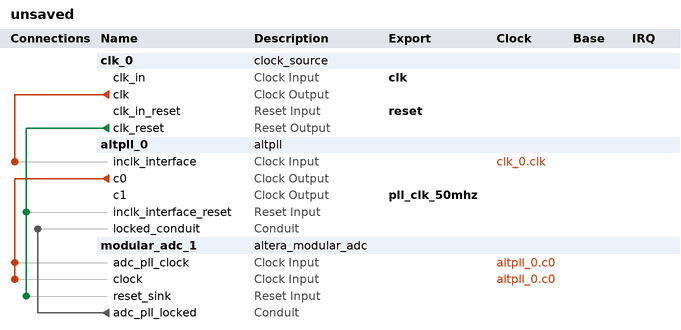
[diagram p0: system contents]
# Platform Designer (Qsys) system unsaved, MAX 10 10M04SAE144C8G
# Parameters at their usual value, and those the tool derives, are not listed.
package require -exact qsys 23.1
create_system unsaved
set_project_property DEVICE_FAMILY {MAX 10}
set_project_property DEVICE 10M04SAE144C8G

add_instance clk_0 clock_source 23.1
set_instance_parameter_value clk_0 clockFrequency 50000000

add_instance altpll_0 altpll 23.1
set_instance_parameter_value altpll_0 CLK0_DIVIDE_BY 24
set_instance_parameter_value altpll_0 CLK0_MULTIPLY_BY 5
set_instance_parameter_value altpll_0 CLK1_DIVIDE_BY 24
set_instance_parameter_value altpll_0 CLK1_DUTY_CYCLE 50
set_instance_parameter_value altpll_0 CLK1_MULTIPLY_BY 25
set_instance_parameter_value altpll_0 CLK1_PHASE_SHIFT 0
set_instance_parameter_value altpll_0 INCLK0_INPUT_FREQUENCY 20833
set_instance_parameter_value altpll_0 OPERATION_MODE NO_COMPENSATION
set_instance_parameter_value altpll_0 PORT_ARESET PORT_UNUSED
set_instance_parameter_value altpll_0 PORT_LOCKED PORT_USED
set_instance_parameter_value altpll_0 PORT_clk1 PORT_USED
set_instance_parameter_value altpll_0 PORT_clk2 PORT_UNUSED
set_instance_parameter_value altpll_0 PORT_clk3 PORT_UNUSED

add_instance modular_adc_1 altera_modular_adc 23.1
set_instance_parameter_value modular_adc_1 CLOCK_FREQ 10000000
set_instance_parameter_value modular_adc_1 CORE_VAR 0
set_instance_parameter_value modular_adc_1 DEVICE_PART 10M04SAE144C8G
set_instance_parameter_value modular_adc_1 clkdiv 2
set_instance_parameter_value modular_adc_1 int_vref_vr 3.3
set_instance_parameter_value modular_adc_1 refsel 1
set_instance_parameter_value modular_adc_1 sample_rate 0
set_instance_parameter_value modular_adc_1 seq_order_length 3
set_instance_parameter_value modular_adc_1 seq_order_slot_1 0
set_instance_parameter_value modular_adc_1 seq_order_slot_2 1
set_instance_parameter_value modular_adc_1 seq_order_slot_3 2
set_instance_parameter_value modular_adc_1 seq_order_slot_4 30
set_instance_parameter_value modular_adc_1 seq_order_slot_5 30
set_instance_parameter_value modular_adc_1 seq_order_slot_6 30
set_instance_parameter_value modular_adc_1 seq_order_slot_7 30
set_instance_parameter_value modular_adc_1 use_ch0 true
set_instance_parameter_value modular_adc_1 use_ch2 true
set_instance_parameter_value modular_adc_1 use_ch3 false
set_instance_parameter_value modular_adc_1 use_ch4 false
set_instance_parameter_value modular_adc_1 use_ch5 false
set_instance_parameter_value modular_adc_1 use_ch6 false
set_instance_parameter_value modular_adc_1 use_ch7 false
set_instance_parameter_value modular_adc_1 use_ch8 false
set_instance_parameter_value modular_adc_1 use_tsd false

# connections
add_connection altpll_0.c0 modular_adc_1.adc_pll_clock clock
add_connection altpll_0.c0 modular_adc_1.clock clock
add_connection clk_0.clk altpll_0.inclk_interface clock
add_connection clk_0.clk_reset altpll_0.inclk_interface_reset reset
add_connection clk_0.clk_reset modular_adc_1.reset_sink reset
add_connection modular_adc_1.adc_pll_locked altpll_0.locked_conduit conduit

# exported interfaces
add_interface clk clock sink
set_interface_property clk EXPORT_OF clk_0.clk_in
add_interface pll_clk_50mhz clock source
set_interface_property pll_clk_50mhz EXPORT_OF altpll_0.c1
add_interface reset reset sink
set_interface_property reset EXPORT_OF clk_0.clk_in_reset

set_interconnect_requirement {$system} qsys_mm.clockCrossingAdapter HANDSHAKE
set_interconnect_requirement {$system} qsys_mm.enableEccProtection FALSE
set_interconnect_requirement {$system} qsys_mm.insertDefaultSlave FALSE
set_interconnect_requirement {$system} qsys_mm.maxAdditionalLatency 1

save_system unsaved.qsys
